# EAGLE schematic interstage_B1v2 (EAGLE 9.6.1)
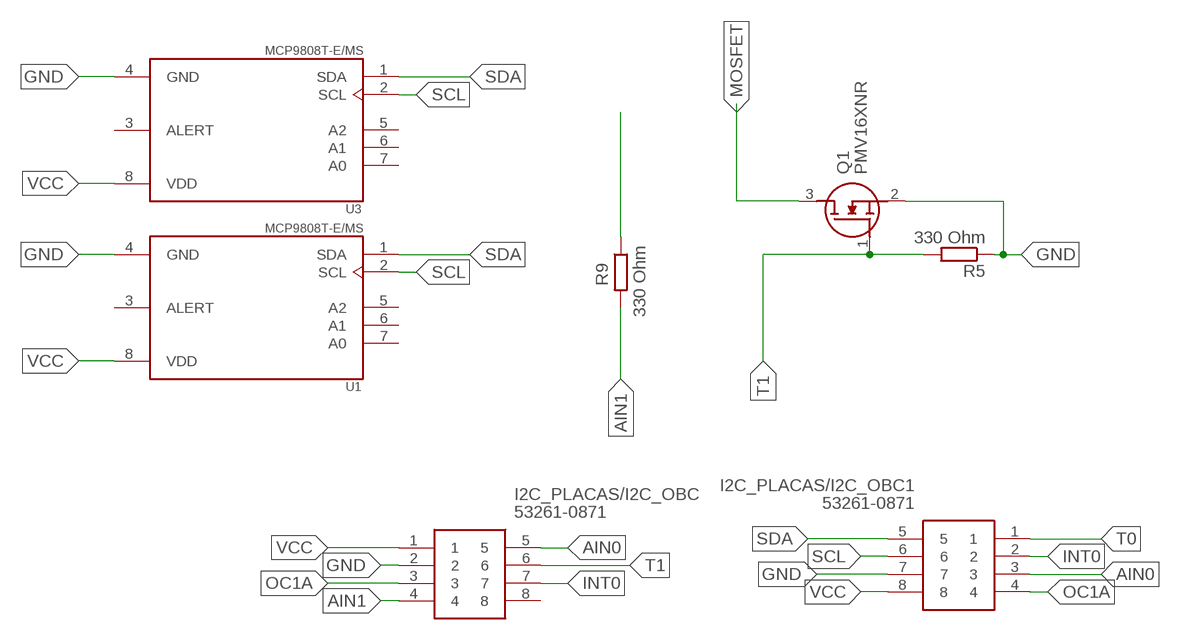
[diagram p0: schematic, sheet 1]

## Parts
I2C_PLACAS/I2C_OBC  53261-0871  [53261-0871]
I2C_PLACAS/I2C_OBC1  53261-0871  [53261-0871]
Q1  PMV16XNR  [SOT95P230X110-3N]
R5  330 Ohm  R-EU_R1206  [R1206]
R9  330 Ohm  R-EU_R1206  [R1206]
U1  MCP9808T-E/MS  [SOP65P490X110-8N]
U3  MCP9808T-E/MS  [SOP65P490X110-8N]

## Nets
AIN0: I2C_PLACAS/I2C_OBC1.3 I2C_PLACAS/I2C_OBC.5
AIN1: I2C_PLACAS/I2C_OBC.4 R9.2
GND: I2C_PLACAS/I2C_OBC1.7 I2C_PLACAS/I2C_OBC.2 Q1.2(S) R5.1 U1.4(GND) U3.4(GND)
INT0: I2C_PLACAS/I2C_OBC1.2 I2C_PLACAS/I2C_OBC.7
MOSFET: Q1.3(D)
N$4: R9.1
OC1A: I2C_PLACAS/I2C_OBC1.4 I2C_PLACAS/I2C_OBC.3
SCL: I2C_PLACAS/I2C_OBC1.6 U1.2(SCL) U3.2(SCL)
SDA: I2C_PLACAS/I2C_OBC1.5 U1.1(SDA) U3.1(SDA)
T0: I2C_PLACAS/I2C_OBC1.1
T1: I2C_PLACAS/I2C_OBC.6 Q1.1(G) R5.2
VCC: I2C_PLACAS/I2C_OBC1.8 I2C_PLACAS/I2C_OBC.1 U1.8(VDD) U3.8(VDD)
Unconnected: I2C_PLACAS/I2C_OBC.8 U1.3(ALERT) U1.5(A2) U1.6(A1) U1.7(A0) U3.3(ALERT) U3.5(A2) U3.6(A1) U3.7(A0)

## Library data of the parts
I2C_PLACAS/I2C_OBC I2C_PLACAS/I2C_OBC1 = SamacSys_Parts:53261-0871: Molex PICOBLADE Series, Series Number 53261, 1.25mm Pitch, 8 Way 1 Row Shrouded Right Angle PCB Header, Surface Mount Source: Datasheet <http://www.molex.com/webdocs/datasheets/pdf/en-us/0532610871_PCB_HEADERS.pdf>; DESCRIPTION: Molex PICOBLADE Series, Series Number 53261, 1.25mm Pitch, 8 Way 1 Row Shrouded Right Angle PCB Header, Surface Mount; HEIGHT: mm; MANUFACTURER_NAME: Molex; MANUFACTURER_PART_NUMBER: 53261-0871; MOUSER_PART_NUMBER: 538-53261-0871; MOUSER_PRICE-STOCK: https://www.mouser.co.uk/ProductDetail/Molex/53261-0871?qs=%252B72YyncTwW%252BggfdCJ7Netw%3D%3D
Q1 = SamacSys_Parts:PMV16XNR: Nexperia PMV16XNR N-channel MOSFET, 8.6 A, 20 V PMV16XN, 3-Pin SOT-23 Source: Datasheet <https://componentsearchengine.com/Datasheets/1/PMV16XNR.pdf>; DESCRIPTION: Nexperia PMV16XNR N-channel MOSFET, 8.6 A, 20 V PMV16XN, 3-Pin SOT-23; HEIGHT: 1.1mm; MANUFACTURER_NAME: Nexperia; MANUFACTURER_PART_NUMBER: PMV16XNR; MOUSER_PART_NUMBER: 771-PMV16XNR; MOUSER_PRICE-STOCK: https://www.mouser.com/Search/Refine.aspx?Keyword=771-PMV16XNR
R5 R9 = rcl:R-EU_: RESISTOR, European symbol; SPICEPREFIX: R
U1 U3 = sensorSPEL:MCP9808T-E/MS: Board Mount Temperature Sensors Silicon temp sensor with I2C interface; DESCRIPTION: Temperature Sensor Digital, Local -40°C ~ 125°C 10 b 8-MSOP; DIGI-KEY_PART_NUMBER: MCP9808T-E/MSCT-ND; MF: Microchip; MP: MCP9808T-E/MS; PACKAGE: MSOP-8 Microchip